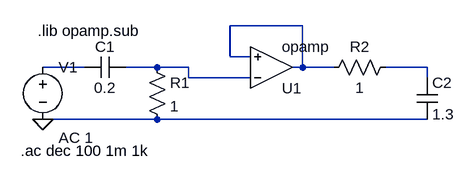
[diagram p0: schematic Ej3.asc]
Ej3.asc, the LTspice schematic file:
Version 4
SHEET 1 880 680
WIRE 256 64 144 64
WIRE 144 112 144 64
WIRE 176 112 144 112
WIRE -80 128 -144 128
WIRE 32 128 -16 128
WIRE 80 128 32 128
WIRE 256 128 256 64
WIRE 256 128 240 128
WIRE 304 128 256 128
WIRE 448 128 384 128
WIRE 80 144 80 128
WIRE 176 144 80 144
WIRE 448 144 448 128
WIRE 32 208 -144 208
WIRE 448 208 32 208
FLAG -144 208 0
SYMBOL cap 432 144 R0
SYMATTR InstName C2
SYMATTR Value 1.3
SYMBOL res 400 112 R90
WINDOW 0 0 56 VBottom 2
WINDOW 3 32 56 VTop 2
SYMATTR InstName R2
SYMATTR Value 1
SYMBOL OpAmps\\opamp 208 192 M180
SYMATTR InstName U1
SYMBOL voltage -144 112 R0
WINDOW 123 24 124 Left 2
SYMATTR InstName V1
SYMATTR Value ""
SYMATTR Value2 AC 1
SYMBOL cap -16 112 R90
WINDOW 0 0 32 VBottom 2
WINDOW 3 32 32 VTop 2
SYMATTR InstName C1
SYMATTR Value 0.2
SYMBOL res 16 112 R0
SYMATTR InstName R1
SYMATTR Value 1
TEXT -178 256 Left 2 !.ac dec 100 1m 1k
TEXT -152 72 Left 2 !.lib opamp.sub

The netlist it stands for:
* Ej3.asc
C2 N004 0 1.3
R2 N004 N001 1
XU1 N003 N001 N001 opamp Aol=100K GBW=10Meg  ; pins invin noninvin out
V1 N002 0 AC 1
C1 N003 N002 0.2
R1 N003 0 1
.ac dec 100 1m 1k
.lib opamp.sub
.backanno
.end